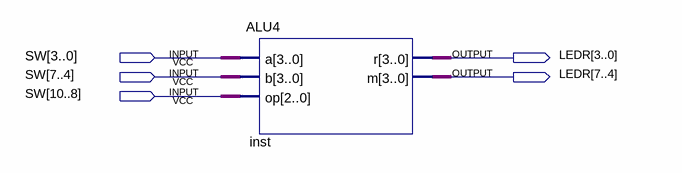
[diagram p0: schematic sheet]
// Quartus schematic ALUDemo.bdf as structural Verilog: 1 symbols, 5 pins
module ALUDemo (
  input  [10:0] SW,
  output [7:0] LEDR
);

  ALU4 inst (.a(SW[3:0]), .b(SW[7:4]), .op(SW[10:8]), .r(LEDR[3:0]), .m(LEDR[7:4]));
endmodule
